# EAGLE design thermocouple board v0.5 (EAGLE 5.10)
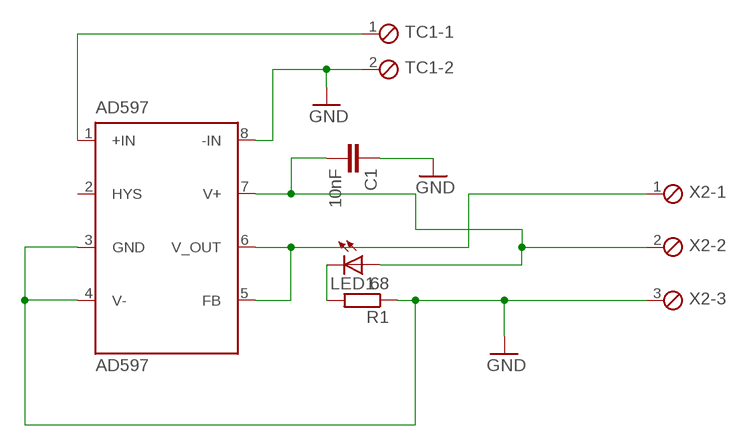
[diagram p0: schematic, sheet 1]

## Parts
AD597  AD597  [SO8]
C1  10nF  C-EUC1206K  [C1206K]
LED1  LEDSMT1206  [1206]
R1  68  R-EU_R1206  [R1206]
TC1  MPT2  [2POL254]
X2  MPT3  [3POL254]

## Nets
5V: AD597.7(V+) C1.2 LED1.A X2.2
GND: AD597.3(GND) AD597.4(V-) AD597.8(-IN) C1.1 R1.1 TC1.2 X2.3
N$1: AD597.1(+IN) TC1.1
N$3: LED1.C R1.2
N$4: AD597.5(FB) AD597.6(V_OUT) X2.1
Unconnected: AD597.2(HYS)

## Library data of the parts
AD597 = analog-devices:AD597
C1 = resistor:C-EU: CAPACITOR, European symbol
LED1 = led:LED: LED OSRAM: - CHIPLED LG R971, LG N971, LY N971, LG Q971, LY Q971, LO R971, LY R971 LH N974, LH R974 LS Q976, LO Q976, LY Q976 LO Q996 - Hyper CHIPLED LW Q18S LB Q993, LB Q99A, LB R99A - SideLED LS A670, LO A670, LY A670, LG A670, LP A670 LB A673, LV A673, LT A673, LW A673 LH A674 LY A675 LS A676, LA A676, LO A676, LY A676, LW A676 LS A679, LY A679, LG A679 - Hyper Micro SIDELED® LS Y876, LA Y876, LO Y876, LY Y876 LT Y87S - SmartLED LW L88C, LW L88S LB L89C, LB L89S, LG L890 LS L89K, LO L89K, LY L89K LS L896, LA L896, LO L896, LY L896 - TOPLED LS T670, LO T670, LY T670, LG T670, LP T670 LSG T670, LSP T670, LSY T670, LOP T670, LYG T670 LG T671, LOG T671, LSG T671 LB T673, LV T673, LT T673, LW T673 LH T674 LS T676, LA T676, LO T676, LY T676, LB T676, LH T676, LSB T676, LW T676 LB T67C, LV T67C, LT T67C, LS T67K, LO T67K, LY T67K, LW E67C LS E67B, LA E67B, LO E67B, LY E67B, LB E67C, LV E67C, LT E67C LW T67C LS T679, LY T679, LG T679 LS T770, LO T770, LY T770, LG T770, LP T770 LB T773, LV T773, LT T773, LW T773 LH T774 LS E675, LA E675, LY E675, LS T675 LS T776, LA T776, LO T776, LY T776, LB T776 LHGB T686 LT T68C, LB T68C - Hyper Mini TOPLED® LB M676 - Mini TOPLED Santana® LG M470 LS M47K, LO M47K, LY M47K Source: http://www.osram.convergy.de LUXEON: - LUMILED® LXK2-PW12-R00, LXK2-PW12-S00, LXK2-PW14-U00, LXK2-PW14-V00 LXK2-PM12-R00, LXK2-PM12-S00, LXK2-PM14-U00 LXK2-PE12-Q00, LXK2-PE12-R00, LXK2-PE12-S00, LXK2-PE14-T00, LXK2-PE14-U00 LXK2-PB12-K00, LXK2-PB12-L00, LXK2-PB12-M00, LXK2-PB14-N00, LXK2-PB14-P00, LXK2-PB14-Q00 LXK2-PR12-L00, LXK2-PR12-M00, LXK2-PR14-Q00, LXK2-PR14-R00 LXK2-PD12-Q00, LXK2-PD12-R00, LXK2-PD12-S00 LXK2-PH12-R00, LXK2-PH12-S00 LXK2-PL12-P00, LXK2-PL12-Q00, LXK2-PL12-R00 Source: www.luxeon.com KINGBRIGHT: KA-3528ASYC Source: www.kingbright.com
R1 = rcl:R-EU_: RESISTOR, European symbol
TC1 = ultimaker-phoenix-mpt3-254:MPT2: PHOENIX CONNECTOR
X2 = ultimaker-phoenix-mpt3-254:MPT3: PHOENIX CONNECTOR

## Board
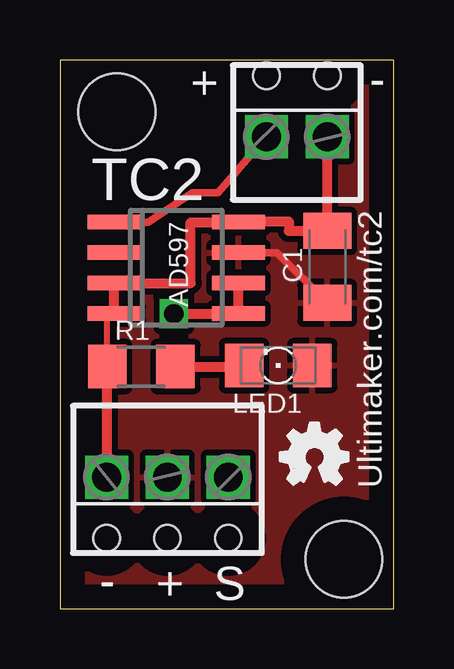
[diagram p1: board, top side]
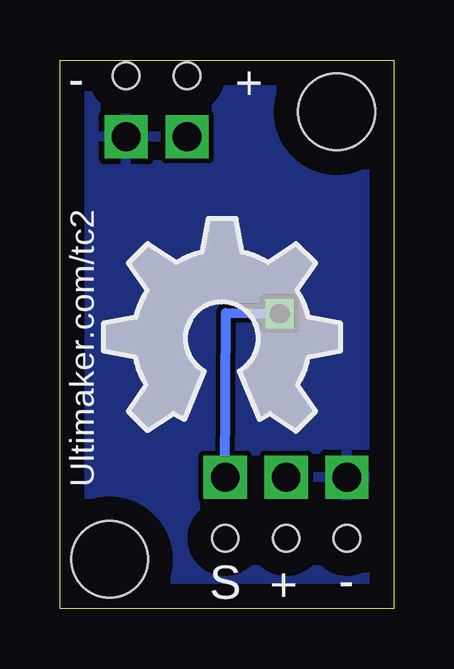
[diagram p2: board, bottom side, seen from below]

Size 13.92 x 22.87 mm. Coordinates in mm from the lower left corner, seen from the top.
Outline: 0,0 13.92,0 13.92,22.87 0,22.87 0,0
Copper layers (1*16): Top 0.035mm / dielectric 1.5mm / Bottom 0.035mm
Design rules "default": minimum track width 10mil, minimum drill 24mil, track to track 8mil, track to pad 8mil, pad to pad 8mil, via to via 8mil, smd to smd 8mil, copper to edge 40mil, drill to drill 8mil, minimum pad ring 10mil, minimum via ring 8mil, stop-mask expansion 4mil, vias tented up to drill 0mil, thermal gap 10mil
Holes 3.2 mm at 2.37,20.71 11.84,2.07

### Footprints (pad centres in the part's own frame; a part is rotated, then mirrored left to right if it is on the bottom)
SO8 = smd 0.6 x 2.2: 1 -1.905,-2.6; 2 -0.635,-2.6; 3 0.635,-2.6; 4 1.905,-2.6; 5 1.905,2.6; 6 0.635,2.6; 7 -0.635,2.6; 8 -1.905,2.6
C1206K = smd 1.5 x 2: 1 -1.5,0; 2 1.5,0
1206 = smd 1.6 x 1.803: A -1.422,0; C 1.422,0
R1206 = smd 1.6 x 1.803: 1 -1.422,0; 2 1.422,0
2POL254 = drill 1.2 square: 1 -1.27,0; 2 1.27,0 | hole 1.1: 1.27,2.54; -1.27,2.54
3POL254 = drill 1.2 square: 1 -2.54,0; 2 0,0; 3 2.54,0 | hole 1.1: -2.54,2.54; 0,2.54; 2.54,2.54

### Placement (x,y rotation side)
AD597  4.85,14.21 270 top
C1  11.15,14.25 270 top
LED1  9.1,10.14 180 top
R1  3.4,10.09 0 top
TC1  9.88,19.67 0 top
U$1  [OSHW_FILL350_NOTEXT_BOTTOM]  2.2,7.4 0 top
U$3  [OSHW_FILLX100_NOTEXT]  9.2,5.2 0 top
X2  4.48,5.49 180 top

### Tracks (layer width: path | path; a pad name or v marks a point on that pad's centre or on a via)
5V
  Top 0.305: AD597.7 9.05,14.85 C1.2
  pour Top (isolate 0.254): 0,0 13.9,0 13.9,22.85 0,22.85
GND
  Top 0.254: AD597.4 2.28,12.28 | R1.1 1.97,12.24
  Top 0.406: TC1.2 C1.1 9.55,15.75 9.55,16.15 7.45,16.15 AD597.8 7.45,16.1 5.45,16.1 5.45,13.58 AD597.3 AD597.4 | X2.3 1.97,5.49 R1.1
  pour Bottom: 0,0.05 13.9,0.05 13.9,22.85 0,22.85
N$1
  Top 0.305: AD597.1 3.68,16.11 5.53,17.35 6.59,17.35 TC1.1
N$3
  Top 0.406: R1.2 7.68,10.1 LED1.C
N$4  (via drill 0.8)
  Top 0.406: AD597.6 AD597.5 v4.75,12.3
  Bottom 0.406: X2.1 7,12.34 v4.75,12.3

### Text on the board
tNames: + | - | TC2 | Ultimaker.com/tc2 | - | + | S
bNames: + | - | Ultimaker.com/tc2 | - | + | S